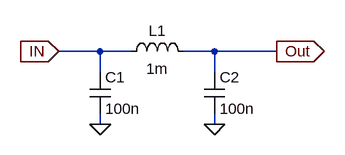
[diagram p0: schematic LP_Filter.asc]
LP_Filter.asc, the LTspice schematic file:
Version 4
SHEET 1 880 680
WIRE 112 128 48 128
WIRE 160 128 112 128
WIRE 288 128 240 128
WIRE 384 128 288 128
WIRE 112 160 112 128
WIRE 288 160 288 128
WIRE 112 240 112 224
WIRE 288 240 288 224
FLAG 48 128 IN
IOPIN 48 128 In
FLAG 384 128 Out
IOPIN 384 128 Out
FLAG 112 240 0
FLAG 288 240 0
SYMBOL ind 144 144 R270
WINDOW 0 32 56 VTop 2
WINDOW 3 5 56 VBottom 2
SYMATTR InstName L1
SYMATTR Value 1m
SYMBOL cap 96 160 R0
SYMATTR InstName C1
SYMATTR Value 100n
SYMBOL cap 272 160 R0
SYMATTR InstName C2
SYMATTR Value 100n

The netlist it stands for:
* LP_Filter.asc
L1 IN Out 1m
C1 IN 0 100n
C2 Out 0 100n
.backanno
.end